# Altium schematic sheet Supply.SchDoc
size A4; DocumentNumber: 6; SheetNumber: 6; SheetTotal: 6
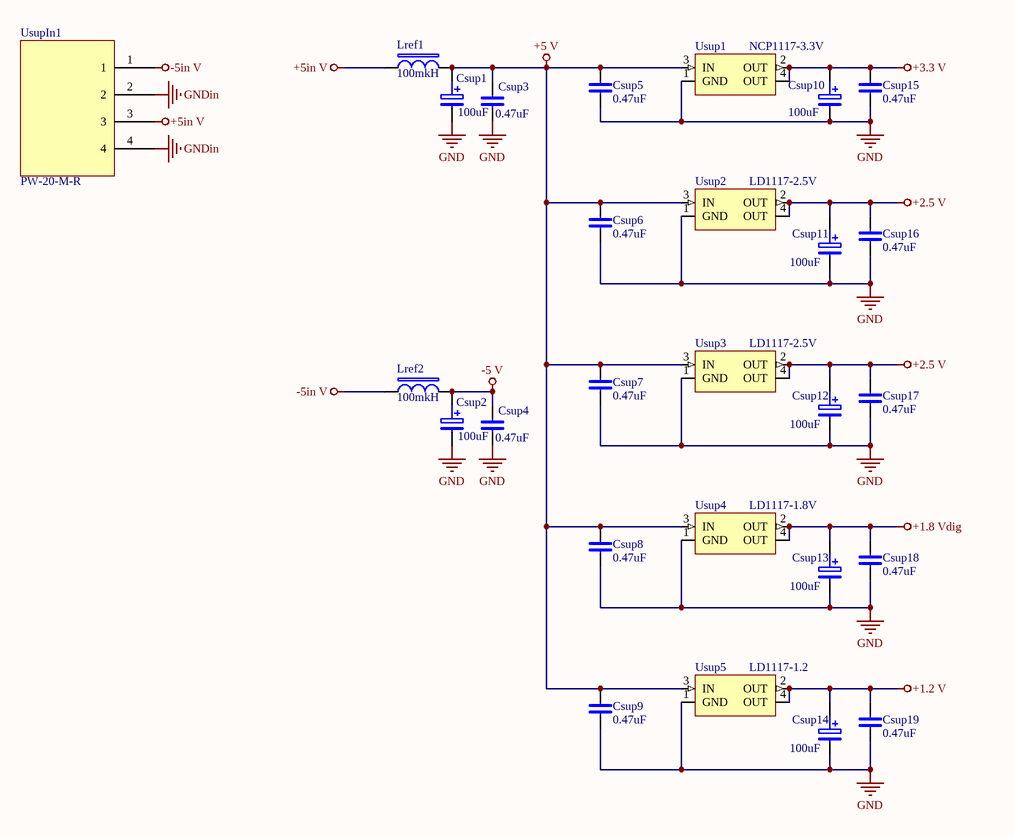
[diagram p0: Supply.SchDoc]

## Parts
Csup1  100uF  [CEL-SMD300]
Csup2  100uF  [CEL-SMD300]
Csup3  0.47uF  [chip0603]
Csup4  0.47uF  [chip0603]
Csup5  0.47uF  [chip0603]
Csup6  0.47uF  [chip0603]
Csup7  0.47uF  [chip0603]
Csup8  0.47uF  [chip0603]
Csup9  0.47uF  [chip0603]
Csup10  100uF  [CEL-SMD300]
Csup11  100uF  [CEL-SMD300]
Csup12  100uF  [CEL-SMD300]
Csup13  100uF  [CEL-SMD300]
Csup14  100uF  [CEL-SMD300]
Csup15  0.47uF  [chip0603]
Csup16  0.47uF  [chip0603]
Csup17  0.47uF  [chip0603]
Csup18  0.47uF  [chip0603]
Csup19  0.47uF  [chip0603]
Lref1  100mkH  [SDR0604]
Lref2  100mkH  [SDR0604]
Usup1  NCP1117-3.3V  [TO-252]
Usup2  LD1117-2.5V  [TO-252]
Usup3  LD1117-2.5V  [TO-252]
Usup4  LD1117-1.8V  [TO-252]
Usup5  LD1117-1.2  [TO-252]
UsupIn1  PW-20-M-R  [PW20-M-R]

## Nets
+1.2 V: Csup14.+ Csup19.1 Usup5.2(OUT) Usup5.4(OUT)
+1.8 Vdig: Csup13.+ Csup18.1 Usup4.2(OUT) Usup4.4(OUT)
+2.5 V: Csup11.+ Csup12.+ Csup16.1 Csup17.1 Usup2.2(OUT) Usup2.4(OUT) Usup3.2(OUT) Usup3.4(OUT)
+3.3 V: Csup10.+ Csup15.1 Usup1.2(OUT) Usup1.4(OUT)
+5 V: Csup1.+ Csup3.1 Csup5.1 Csup6.1 Csup7.1 Csup8.1 Csup9.1 Lref1.2 Usup1.3(IN) Usup2.3(IN) Usup3.3(IN) Usup4.3(IN) Usup5.3(IN)
+5in V: Lref1.1 UsupIn1.3
-5 V: Csup2.+ Csup4.1 Lref2.2
-5in V: Lref2.1 UsupIn1.1
GND: Csup1.- Csup2.- Csup3.2 Csup4.2 Csup5.2 Csup6.2 Csup7.2 Csup8.2 Csup9.2 Csup10.- Csup11.- Csup12.- Csup13.- Csup14.- Csup15.2 Csup16.2 Csup17.2 Csup18.2 Csup19.2 Usup1.1(GND) Usup2.1(GND) Usup3.1(GND) Usup4.1(GND) Usup5.1(GND)
GNDin: UsupIn1.2 UsupIn1.4

## Library data of the parts
Csup1 Csup2 Csup10-Csup14 = C POL: Text Field1: 20; Text Field2: 20
Csup3-Csup9 Csup15-Csup19 = C: Text Field1: 20; Text Field2: 10
Lref1 Lref2 = DR: Text Field1: 30; Text Field2: 10
Usup2-Usup5 = NCP1117-3.3V